# Altium schematic sheet Half H-Bridge Driver.SchDoc: N-FET Driver
size Letter; Date: 2017-02-04; DocumentNumber: 3; Revision: A; SheetNumber: 3; SheetTotal: 16; DesignedBy: Mike MacKay
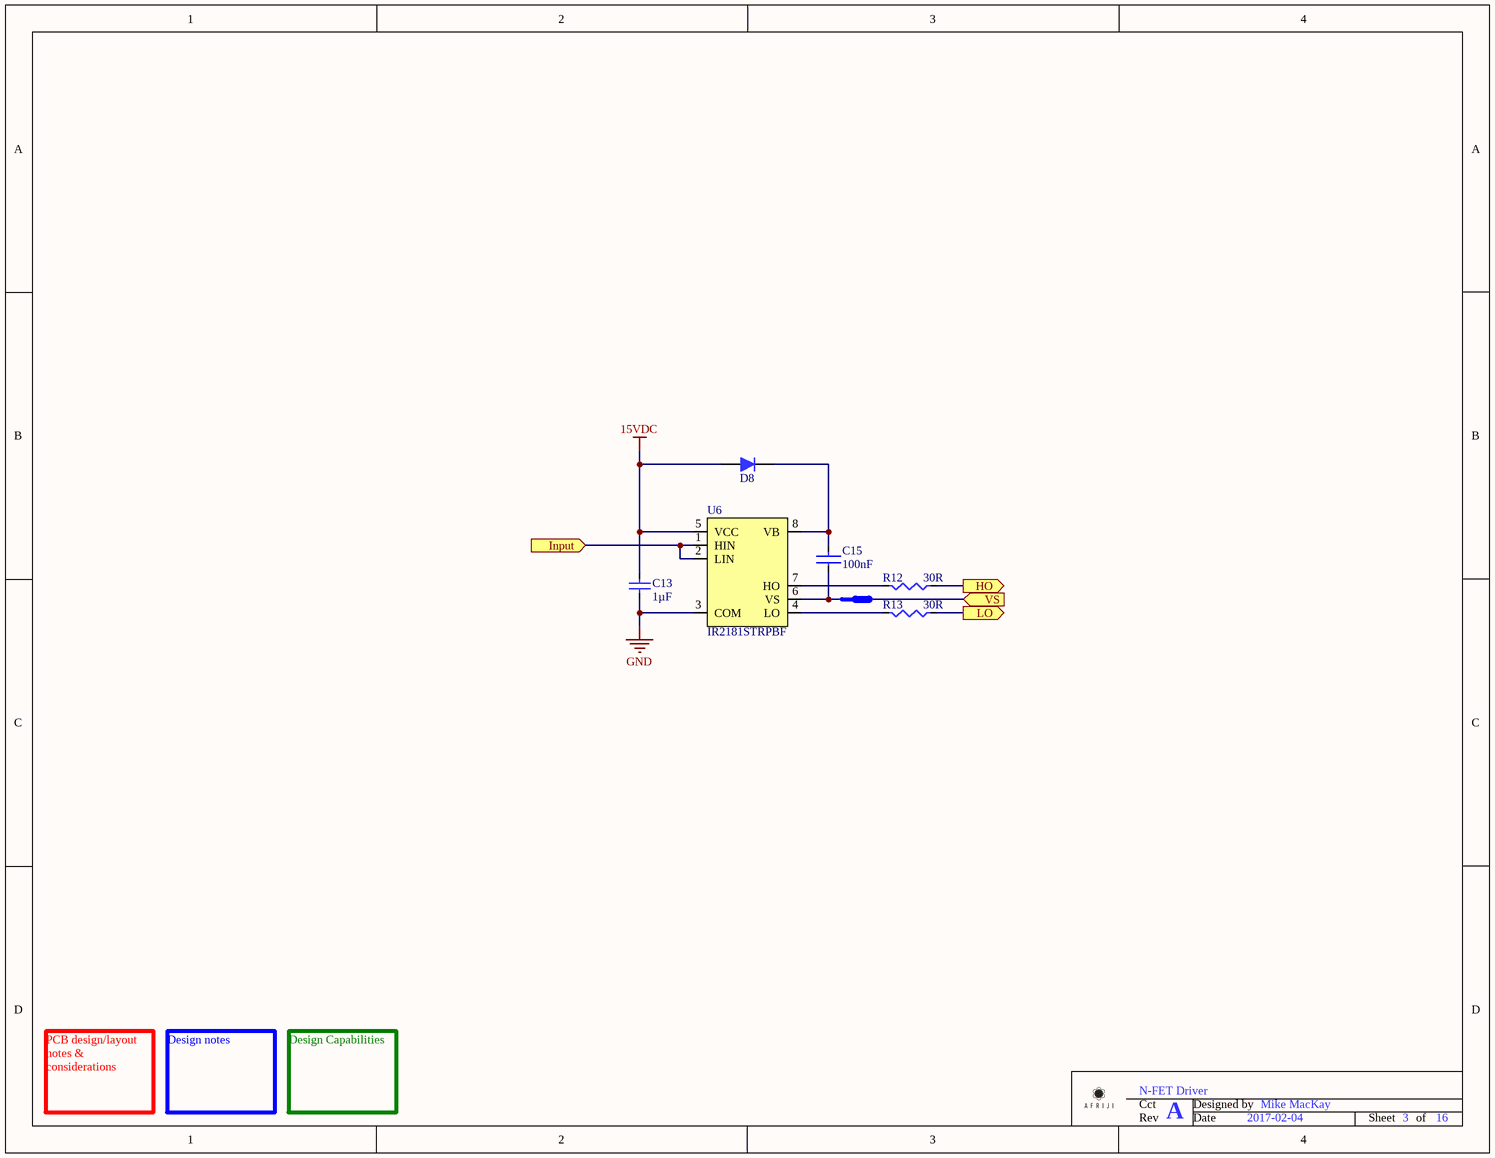
[diagram p0: Half H-Bridge Driver.SchDoc]

## Parts
C13  Capacitance: 1µF  [Capacitor - 0603 Ceramic]  (hidden comment: 1uF 0603 25V)
C15  Capacitance: 100nF  [C0603 - Ceramic]  (hidden comment: 100nF 0603 50V)
D8  (no value)  [SMA - Diode]
NetTie1  Net Tie  [Net tie (7/7 mil)]  (value not drawn)  (net tie, no BOM)
R12  Resistance (Ohms): 30R  [R0603]  (hidden comment: Template - Resistor)
R13  Resistance (Ohms): 30R  [R0603]  (hidden comment: Template - Resistor)
U6  Manufacturer Part Number: IR2181STRPBF  [SOIC-8]  (hidden comment: H-Bridge Driver)

## Ports
HO (out), Input (in), LO (out), VS (in)

## Nets
15VDC: C13.1 D8.1(Anode) U6.5(VCC)
GND: C13.2 U6.3(COM)
HO: R12.2 ; port HO
Input: U6.1(HIN) U6.2(LIN) ; port Input
LO: R13.2 ; port LO
VS: NetTie1.2 ; port VS
NetC15_1: C15.1 D8.2(Cathode) U6.8(VB)
NetC15_2: C15.2 NetTie1.1 U6.6(VS)
NetR12_1: R12.1 U6.7(HO)
NetR13_1: R13.1 U6.4(LO)

## Notes on the sheet
- PCB design/layout notes & considerations
- Design notes
- Design Capabilities
- Cct
- Designed by
- Rev
- Date
- Sheet
- of

## Library data of the parts
C13 = 1uF 0603 25V: Non-polarized; Manufacturer: Murata Electronics North America; Manufacturer Part Number: GRM188R61E105KA12D; Value: 1uF 0603 16V; Tolerance: ±10%; Temperature Coefficient: X5R; Technology: SMT; Supplier 1: Digi-Key; RoHS: RoHS Compliant; Category: Capacitors; Stock 1: 1582906; Pricing 1: 1=0.14, 10=0.059, 50=0.0322, 100=0.0273, 250=0.02232, 500=0.01908, 1000=0.01488 (CAD); Packaging: Cut Tape (CT); Voltage - Rated: 25V; Mounting Type: Surface Mount, MLCC; Operating Temperature: -55°C ~ 85°C; Applications: General Purpose; Ratings: -; Package / Case: 0603 (1608 Metric); Size / Dimension: 0.063" L x 0.031" W (1.60mm x 0.80mm); Height - Seated (Max): -; Thickness (Max): 0.035" (0.90mm); Lead Spacing: -; Features: -; Lead Style: -; ComponentLink1URL: http://www.murata.com/~/media/webrenewal/support/library/catalog/products/capacitor/mlcc/c02e.ashx; ComponentLink1Description: Spec Sheet; Supplier Part Number 1: 490-3897-1-ND
C15 = 100nF 0603 50V: Manufacturer: Samsung Electro-Mechanics America, Inc; Manufacturer Part Number: CL10B104KB8SFNC; Tolerance: ±10%; Temperature Coefficient: X7R; Value: 100nF 0603 50V; Supplier 1: Digi-Key; RoHS: RoHS Compliant; Category: Capacitors; Stock 1: 1192070; Pricing 1: 1=0.1, 10=0.027, 25=0.0192, 100=0.0125, 500=0.00874, 1000=0.00681 (USD); Packaging: Cut Tape (CT); Voltage - Rated: 50V; Mounting Type: Surface Mount, MLCC; Operating Temperature: -55°C ~ 125°C; Applications: Boardflex Sensitive; Ratings: -; Package / Case: 0603 (1608 Metric); Size / Dimension: 0.063" L x 0.031" W (1.60mm x 0.80mm); Height - Seated (Max): -; Thickness (Max): 0.035" (0.90mm); Lead Spacing: -; Features: Soft Termination; Lead Style: -; ComponentLink1URL: http://www.samsungsem.com/kr/front/downloadcms.do?path=/kr/support/product-search/mlcc/__icsFiles/afieldfile/2014/11/05&fileName=S_CL10B104KB8SFNC.pdf; ComponentLink1Description: http://www.samsungsem.com/kr/front/downloadcms.do?path=/kr/support/product-search/mlcc/__icsFiles/afieldfile/2014/11/05&fileName=S_CL10B104KB8SFNC.pdf; Supplier Part Number 1: 1276-1936-1-ND
D8 = Diode - Signal 1A: Signal Diode; Manufacturer: Vishay Semiconductor Diodes Division; Manufacturer Part Number: US1G-E3/5AT; Diode Type: Standard; Voltage - DC Reverse (Vr) (Max): 400V; Current - Average Rectified (Io): 1A; Voltage - Forward (Vf) (Max) @ If: 1V @ 1A; Speed: Fast Recovery =< 500ns, > 200mA (Io); Reverse Recovery Time (trr): 50ns; Current - Reverse Leakage @ Vr: 10µA @ 400V; Capacitance @ Vr, F: 15pF @ 4V, 1MHz; Supplier 1: Digi-Key; Supplier Part Number 1: US1G-E3/5ATGICT-ND; RoHS: RoHS Compliant; Category: Discrete Semiconductor Products; Stock 1: 29002; Pricing 1: 1=0.41, 10=0.312, 25=0.2816, 100=0.1945, 250=0.1638, 500=0.1331, 1000=0.10238, 2500=0.09214 (USD); Packaging: Cut Tape (CT); Part Status: Active; Mounting Type: Surface Mount; Package / Case: DO-214AC, SMA; Supplier Device Package: DO-214AC (SMA); Operating Temperature - Junction: -55°C ~ 150°C; ComponentLink1URL: http://www.vishay.com/docs/88768/us1.pdf; ComponentLink1Description: Spec Sheet
NetTie1 = Net Tie: Ties two nets together
R12 R13 = Template - Resistor: Manufacturer: Yageo; Manufacturer Part Number: RC0603FR-0730RL; Tolerance: ±1%; Power (Watts): 0.1W, 1/10W; Temperature Coefficient: ±100ppm/°C; Supplier 1: Digi-Key; Supplier Part Number 1: 311-30.0HRCT-ND; RoHS: RoHS Compliant; Category: Resistors; Stock 1: 158658; Pricing 1: 1=0.1, 10=0.013, 25=0.0092, 50=0.007, 100=0.0052, 250=0.00396, 500=0.00316, 1000=0.00233 (USD); Packaging: Cut Tape (CT); Part Status: Active; Composition: Thick Film; Features: Moisture Resistant; Operating Temperature: -55°C ~ 155°C; Package / Case: 0603 (1608 Metric); Supplier Device Package: 0603; Size / Dimension: 0.063" L x 0.031" W (1.60mm x 0.80mm); Height - Seated (Max): 0.022" (0.55mm); Number of Terminations: 2; Failure Rate: -; ComponentLink1URL: http://www.yageo.com/NewPortal/yageodocoutput?fileName=/pdf/R-Chip/PYu-RC_Group_51_RoHS_L_4.pdf; ComponentLink1Description: Spec Sheet
U6 = H-Bridge Driver: Manufacturer: Infineon Technologies; Driven Configuration: Half-Bridge; Channel Type: Independent; Gate Type: IGBT, N-Channel MOSFET; Voltage - Supply: 10 V ~ 20 V; Logic Voltage - VIL, VIH: 0.8V, 2.7V; Current - Peak Output (Source, Sink): 1.9A, 2.3A; Input Type: Non-Inverting; High Side Voltage - Max (Bootstrap): 600V; Rise / Fall Time (Typ): 40ns, 20ns; Supplier 1: Digi-Key; RoHS: RoHS Compliant; Category: Integrated Circuits (ICs); Stock 1: 2915; Pricing 1: 1=3.06, 10=2.75, 100=2.2535, 500=1.9184, 1000=1.61792 (USD); Packaging: Cut Tape (CT); Part Status: Active; Operating Temperature: -40°C ~ 150°C (TJ); Mounting Type: Surface Mount; Package / Case: 8-SOIC (0.154", 3.90mm Width); Supplier Device Package: 8-SOIC; ComponentLink1URL: http://www.irf.com/product-info/datasheets/data/ir2181.pdf; ComponentLink1Description: Spec Sheet; Supplier Part Number 1: IR2181SPBFCT-ND